# EAGLE design FLC100_remote_v1.2 (EAGLE 6.2)
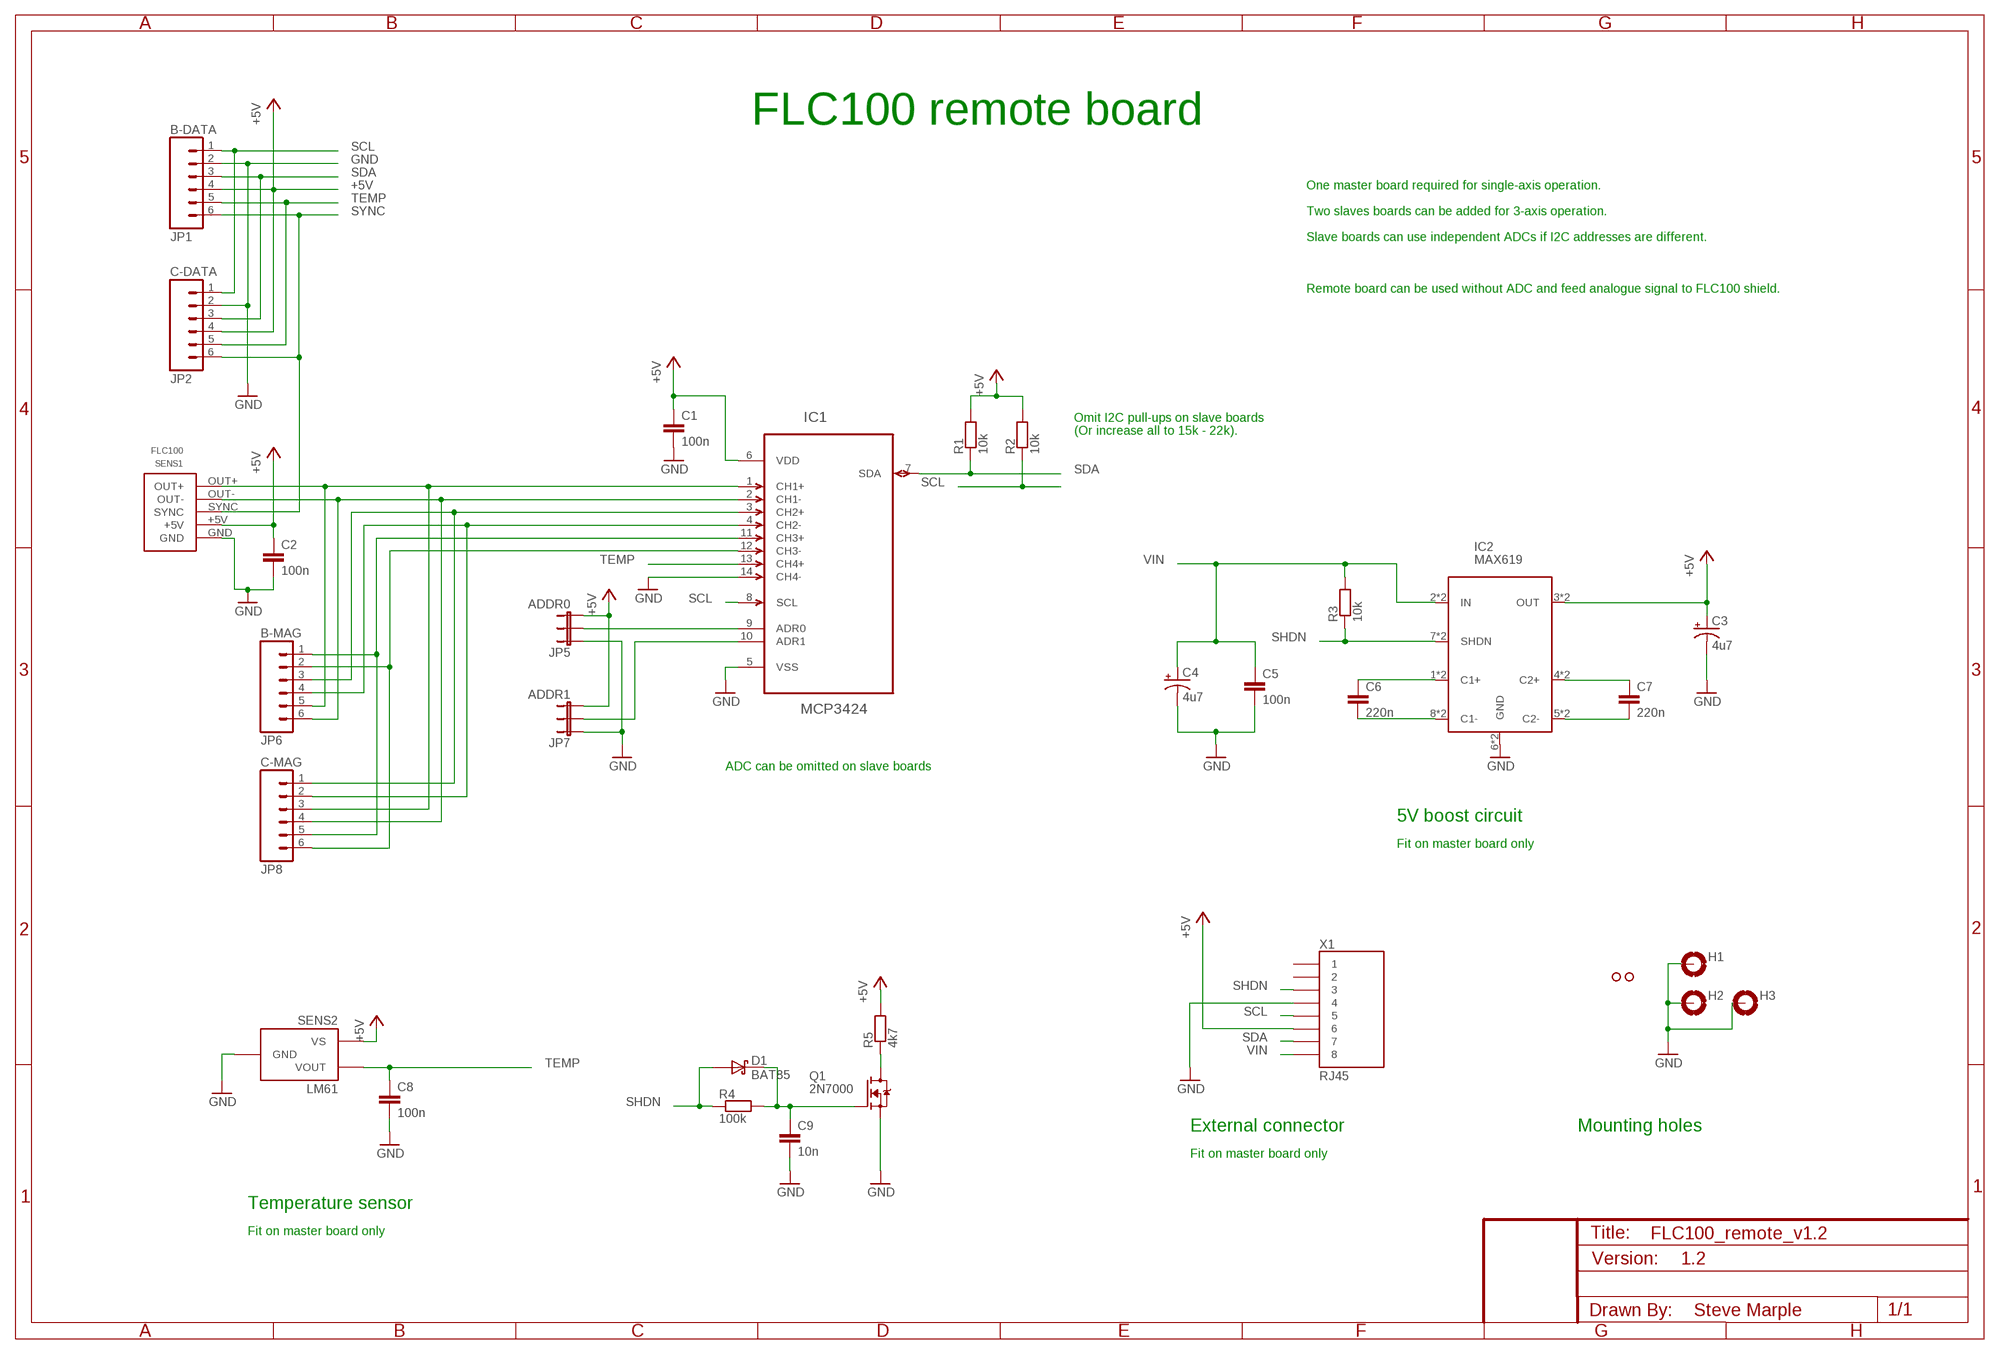
[diagram p0: schematic, sheet 1]

## Parts
C1  100n  CAPPTH  [CAP-PTH-SMALL]
C2  100n  CAPPTH  [CAP-PTH-SMALL]
C3  4u7  CAP_POLPTH2  [CPOL-RADIAL-10UF-25V]
C4  4u7  CAP_POLPTH2  [CPOL-RADIAL-10UF-25V]
C5  100n  CAPPTH  [CAP-PTH-SMALL]
C6  220n  CAPPTH1  [CAP-PTH-5MM]
C7  220n  CAPPTH1  [CAP-PTH-5MM]
C8  100n  CAPPTH  [CAP-PTH-SMALL]
C9  10n  CAPPTH  [CAP-PTH-SMALL]
D1  BAT85  DIODE-SCHOTTKY  [DIODE-TH-0.4]
H1  MOUNT-PAD-ROUND3.0  [3,0-PAD]
H2  MOUNT-PAD-ROUND3.0  [3,0-PAD]
H3  MOUNT-PAD-ROUND3.0  [3,0-PAD]
IC1  MCP3424  MCP3424-E/SLSO14  [SO14]
IC2  MAX619  MAX619DIL08/SOIC8  [DIL08-SOIC8]
JP1  B-DATA  M06FEMALE  [1X06_FEMALE]
JP2  C-DATA  M06FEMALE  [1X06_FEMALE]
JP5  ADDR0  JUMPER-3PTH  [1X03]
JP6  B-MAG  M06FEMALE  [1X06_FEMALE]
JP7  ADDR1  JUMPER-3PTH  [1X03]
JP8  C-MAG  M06FEMALE  [1X06_FEMALE]
Q1  2N7000  [TO-92]
R1  10k  RESISTOR  [RES-AXIAL-0.4]
R2  10k  RESISTOR  [RES-AXIAL-0.4]
R3  10k  RESISTOR  [RES-AXIAL-0.4]
R4  100k  RESISTOR  [RES-AXIAL-0.4]
R5  4k7  RESISTOR  [RES-AXIAL-0.4]
SENS1  FLC100  [FLC100]
SENS2  LM61  [TO-92]
U$1  PAD  [PAD]
U$2  PAD  [PAD]
X1  RJ45  RJ45-8PTH  [RJ45-8]

## Nets
+5V [power]: C1.1 C2.1 C3.1(+) IC1.6(VDD) IC2.3(OUT) IC2.3@1(OUT) JP1.4 JP2.4 JP5.3 JP7.3 R1.P$2 R2.P$2 R5.P$2 SENS1.+5V SENS2.1(VS) X1.6
CH1+: IC1.1(CH1+) JP6.5 JP8.3 SENS1.OUT+
CH1-: IC1.2(CH1-) JP6.6 JP8.4 SENS1.OUT-
CH2+: IC1.3(CH2+) JP6.3 JP8.1
CH2-: IC1.4(CH2-) JP6.4 JP8.2
CH3+: IC1.11(CH3+) JP6.1 JP8.5
CH3-: IC1.12(CH3-) JP6.2 JP8.6
GND [power]: C1.2 C2.2 C3.2(-) C4.2(-) C5.2 C8.2 C9.2 H1.B3,0(MOUNT) H2.B3,0(MOUNT) H3.B3,0(MOUNT) IC1.5(VSS) IC1.14(CH4-) IC2.6(GND) IC2.6@1(GND) JP1.2 JP2.2 JP5.1 JP7.1 Q1.1(S) SENS1.GND SENS2.3(GND) X1.4
N$2: C9.1 D1.C Q1.2(G) R4.P$2
N$3: Q1.3(D) R5.P$1
N$6: C6.2 IC2.8(C1-) IC2.8@1(C1-)
N$7: C6.1 IC2.1(C1+) IC2.1@1(C1+)
N$11: IC1.9(ADR0) JP5.2
N$12: IC1.10(ADR1) JP7.2
N$14: C7.1 IC2.4(C2+) IC2.4@1(C2+)
N$15: C7.2 IC2.5(C2-) IC2.5@1(C2-)
SCL: IC1.8(SCL) JP1.1 JP2.1 R2.P$1 X1.5
SDA: IC1.7(SDA) JP1.3 JP2.3 R1.P$1 X1.7
SHDN: D1.A IC2.7(SHDN) IC2.7@1(SHDN) R3.P$1 R4.P$1 X1.3
SYNC: JP1.6 JP2.6 SENS1.SYNC
TEMP: C8.1 IC1.13(CH4+) JP1.5 JP2.5 SENS2.2(VOUT)
VIN [power]: C4.1(+) C5.1 IC2.2(IN) IC2.2@1(IN) R3.P$2 X1.8
Unconnected: U$1.1 U$2.1 X1.1 X1.2

## Notes on the sheet
- FLC100 remote board
- One master board required for single-axis operation.
- Two slaves boards can be added for 3-axis operation.
- Slave boards can use independent ADCs if I2C addresses are different.
- Remote board can be used without ADC and feed analogue signal to FLC100 shield.
- Omit I2C pull-ups on slave boards
- (Or increase all to 15k - 22k).
- ADC can be omitted on slave boards
- 5V boost circuit
- Fit on master board only
- External connector | Mounting holes
- Fit on master board only
- Temperature sensor
- Fit on master board only
- 1.2
- Steve Marple

## Library data of the parts
C1 C2 C5-C9 = SparkFun:CAP: Capacitor Standard 0603 ceramic capacitor, and 0.1" leaded capacitor.
C3 C4 = SparkFun:CAP_POL: Capacitor Polarized These are standard SMD and PTH capacitors. Normally 10uF, 47uF, and 100uF in electrolytic and tantalum varieties. Always verify the external diameter of the through hole cap, it varies with capacity, voltage, and manufacturer. The EIA devices should be standard.
D1 = SteveMarple:DIODE-SCHOTTKY
H1-H3 = holes:MOUNT-PAD-ROUND: MOUNTING PAD, round
IC1 = SteveMarple:MCP3424-E/SL: Analog-to-Digital Converter Footprint adapted from Eagle file from Onecall web site
IC2 = SteveMarple:MAX619: Regulated 5V charge pump DC-DC converter
JP1 JP2 JP6 JP8 = SteveMarple:M06: Header 6 Standard 6-pin 0.1" header. Use with straight break away headers (SKU : PRT-00116), right angle break away headers (PRT-00553), swiss pins (PRT-00743), machine pins (PRT-00117), and female headers (PRT-00115). Molex polarized connector foot print use with SKU : PRT-08094 with associated crimp pins and housings. NOTES ON THE VARIANTS LOCK and LOCK_LONGPADS... This footprint was designed to help hold the alignment of a through-hole component (i.e. 6-pin header) while soldering it into place. You may notice that each hole has been shifted either up or down by 0.005 of an inch from it's more standard position (which is a perfectly straight line). This slight alteration caused the pins (the squares in the middle) to touch the edges of the holes. Because they are alternating, it causes a "brace" to hold the component in place. 0.005 has proven to be the perfect amount of "off-center" position when using our standard breakaway headers. Although looks a little odd when you look at the bare footprint, once you have a header in there, the alteration is very hard to notice. Also, if you push a header all the way into place, it is covered up entirely on the bottom side. This idea of altering the position of holes to aid alignment will be further integrated into the Sparkfun Library for other footprints. It can help hold any component with 3 or more connection pins.
JP5 JP7 = SparkFun:JUMPER-3
Q1 = SteveMarple:2N7000: 2N7000 FET
R1-R5 = SteveMarple:RESISTOR: 1/4W PTH resistor
SENS1 = SteveMarple:FLC100: Stefan Mayer Instruments FLC100 fluxgate magnetometer sensor
SENS2 = SteveMarple:LM61
U$1 U$2 = SteveMarple:PAD
X1 = SteveMarple:RJ45-8: RJ45 Jack Simple RJ45, 8-pin connection - connector for common Cat5, Cat5e, and Cat6 Ethernet cables. Footprint not yet proven in production. Connector sku is PRT-00643; Breakout PCB sku is BOB-00716.

## Net classes
1 power: width 0.381 mm

## Board
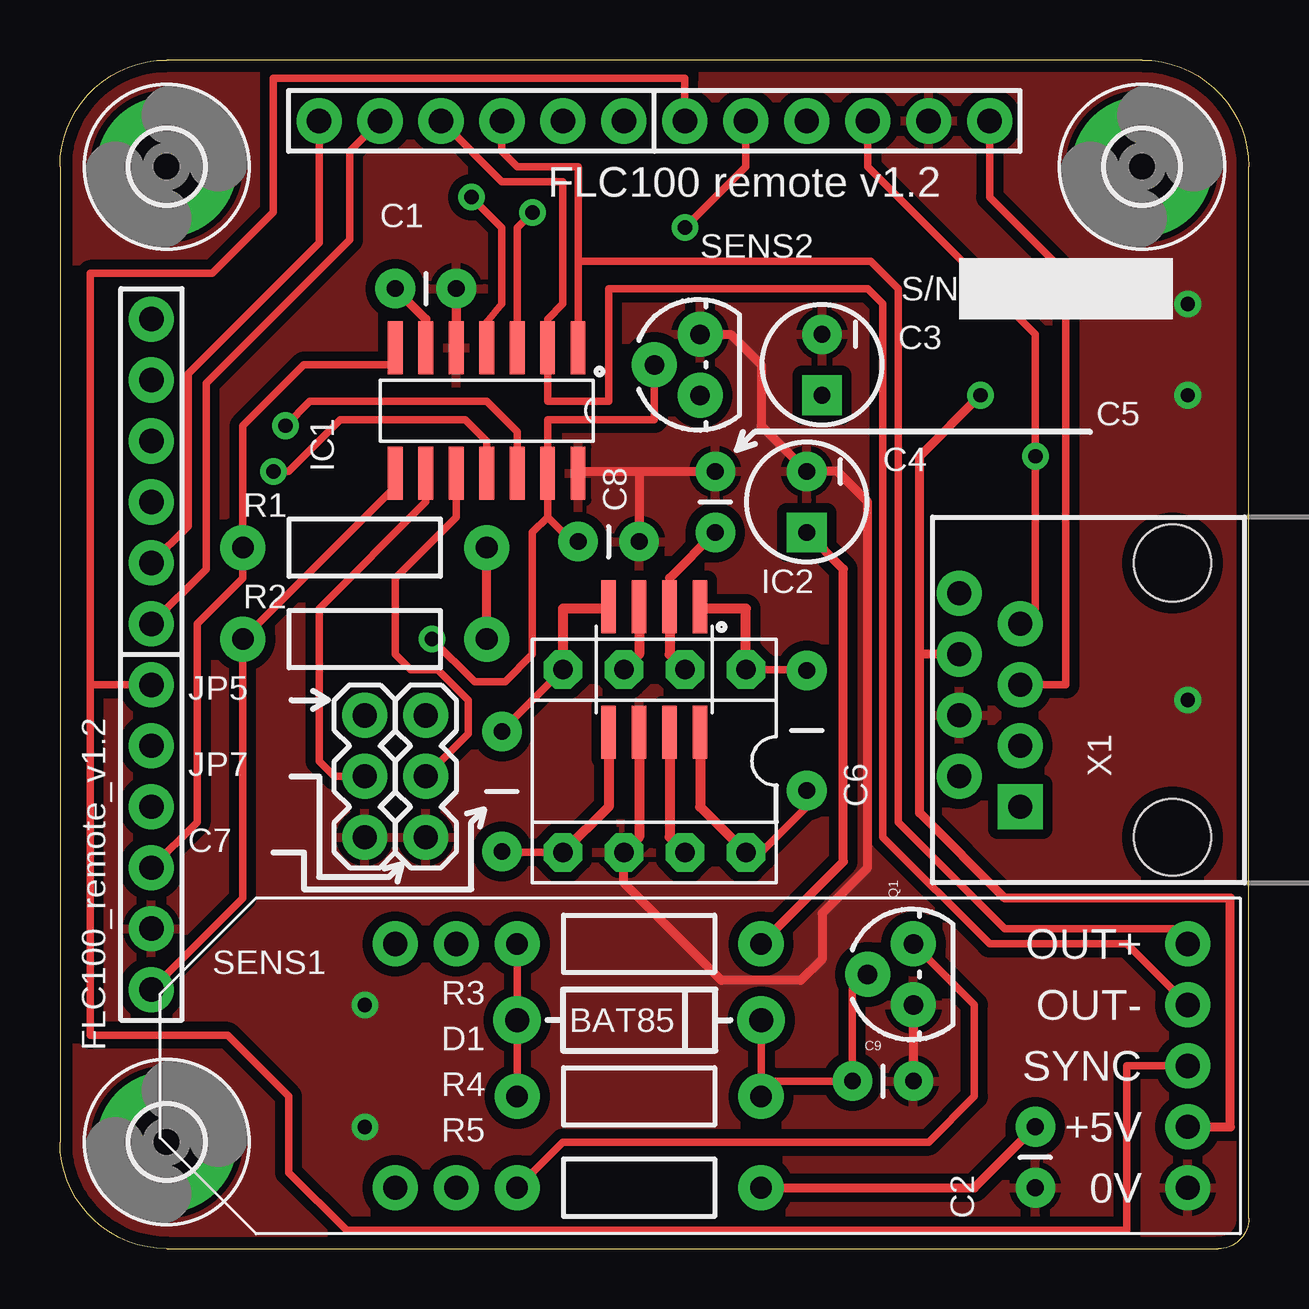
[diagram p1: board, top side]
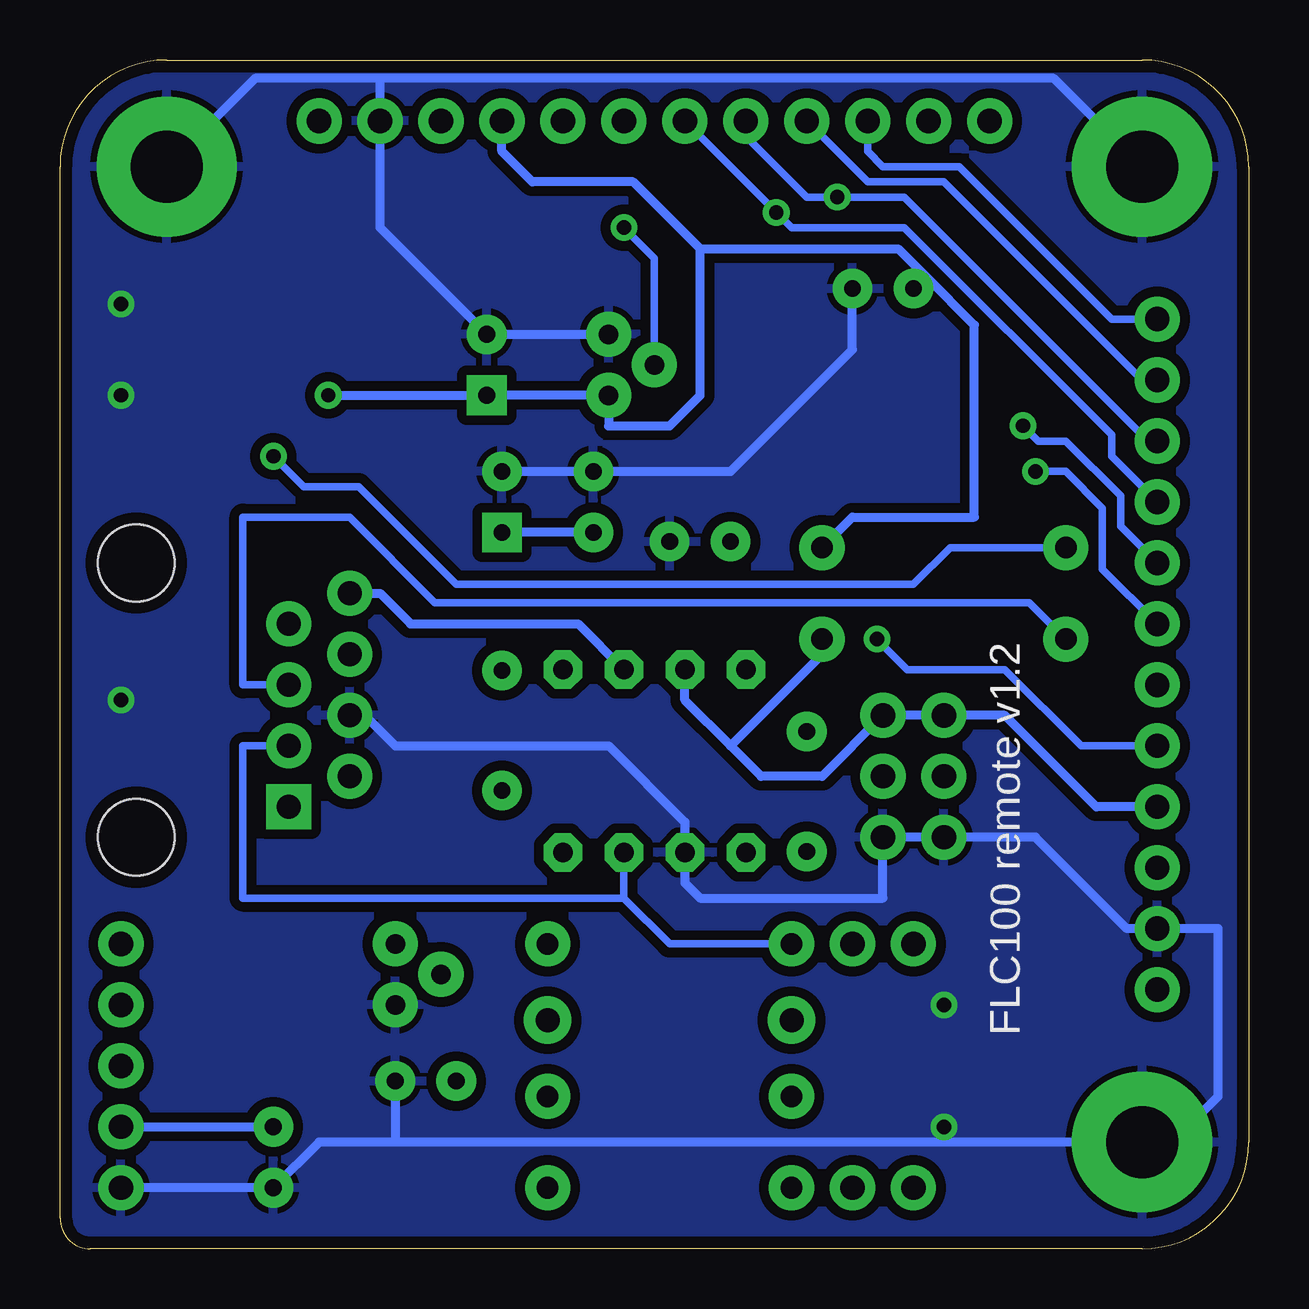
[diagram p2: board, bottom side, seen from below]

Size 49.53 x 49.53 mm. Coordinates in mm from the lower left corner, seen from the top.
Outline: 4.45,0 48.26,0 arc90 49.53,1.27 49.53,45.09 arc90 45.09,49.53 4.45,49.53 arc90 0,45.09 0,4.45 arc90 4.45,0
Copper layers (1*16): Top 0.035mm / dielectric 1.5mm / Bottom 0.035mm
Design rules: minimum track width 10mil, minimum drill 20mil, track to track 10mil, track to pad 10mil, pad to pad 10mil, via to via 10mil, smd to smd 10mil, copper to edge 0.5mm, drill to drill 8mil, minimum pad ring 12mil, minimum via ring 10mil, stop-mask expansion 4mil, vias tented up to drill 25mil, thermal gap 10mil

### Footprints (pad centres in the part's own frame; a part is rotated, then mirrored left to right if it is on the bottom)
CAP-PTH-SMALL = drill 0.7 pad 1.651: 1 0,0; 2 2.54,0
CPOL-RADIAL-10UF-25V = drill 0.7 pad 1.651 square: 1 1.27,0 | drill 0.7 pad 1.651: 2 -1.27,0
CAP-PTH-5MM = drill 0.7 pad 1.651: 1 -2.5,0; 2 2.5,0
DIODE-TH-0.4 = drill 1 pad 1.981: A -5.08,0; C 5.08,0
3,0-PAD = drill 3 pad 5.842: B3,0 0,0
SO14 = smd 0.61 x 2.21: 1 -3.81,-2.616; 2 -2.54,-2.616; 3 -1.27,-2.616; 4 0,-2.616; 5 1.27,-2.616; 6 2.54,-2.616; 7 3.81,-2.616; 8 3.81,2.616; 9 2.54,2.616; 10 1.27,2.616; 11 0,2.616; 12 -1.27,2.616; 13 -2.54,2.616; 14 -3.81,2.616
DIL08-SOIC8 = drill 0.813 pad 1.6 octagon: 1 -3.81,-3.81; 2 -1.27,-3.81; 3 1.27,-3.81; 4 3.81,-3.81; 5 3.81,3.81; 6 1.27,3.81; 7 -1.27,3.81; 8 -3.81,3.81 | smd 0.61 x 2.21: 1@1 -1.905,-6.426; 2@1 -0.635,-6.426; 3@1 0.635,-6.426; 4@1 1.905,-6.426; 5@1 1.905,-1.194; 6@1 0.635,-1.194; 7@1 -0.635,-1.194; 8@1 -1.905,-1.194
1X06_FEMALE = drill 1.016 pad 1.88: 1 0,0; 2 2.54,0; 3 5.08,0; 4 7.62,0; 5 10.16,0; 6 12.7,0
1X03 = drill 1.016 pad 1.88: 1 0,0; 2 2.54,0; 3 5.08,0
TO-92 = drill 0.813 pad 1.88: 1 -1.27,0; 2 0,1.905; 3 1.27,0
RES-AXIAL-0.4 = drill 0.9 pad 1.88: P$1 -5.08,0; P$2 5.08,0
FLC100 = drill 1.016 pad 1.88: +5V -20.32,2.54; GND -20.32,5.08; NC@0 12.7,5.08; NC@1 12.7,-5.08; OUT+ -20.32,-5.08; OUT- -20.32,-2.54; SYNC -20.32,0
PAD = drill 1.016 pad 1.88: 1 0,0
RJ45-8 = drill 1 pad 1.88 square: 1 -4.445,6.35 | drill 1 pad 1.88: 2 -3.175,8.89; 3 -1.905,6.35; 4 -0.635,8.89; 5 0.635,6.35; 6 1.905,8.89; 7 3.175,6.35; 8 4.445,8.89 | hole 3.2: -5.715,0; 5.715,0

### Placement (x,y rotation side)
C1  13.97,40.01 0 top
C2  40.64,5.08 270 top
C3  31.75,36.83 270 top
C4  31.11,31.11 270 top
C5  27.3,29.84 90 top
C6  31.11,21.59 270 top
C7  18.41,19.05 270 top
C8  21.59,29.46 0 top
C9  33.02,6.99 0 top
D1  24.13,9.53 0 top
H1  4.45,4.45 0 top
H2  45.09,45.09 0 top
H3  4.45,45.09 0 top
IC1  17.78,34.92 180 top
IC2  24.77,20.32 180 top
JP1  3.81,10.79 90 top
JP2  38.73,46.99 180 top
JP5  12.7,17.14 90 top
JP6  3.81,26.04 90 top
JP7  15.24,17.14 90 top
JP8  23.5,46.99 180 top
Q1  35.56,11.43 90 top
R1  12.7,29.21 0 top
R2  12.7,25.4 0 top
R3  24.13,12.7 0 top
R4  24.13,6.35 0 top
R5  24.13,2.54 0 top
SENS1  26.67,7.62 180 top
SENS2  26.67,36.83 90 top
U$1  16.51,12.7 0 top
U$2  16.51,2.54 0 top
X1  46.35,22.86 90 top

### Tracks (layer width: path | path; a pad name or v marks a point on that pad's centre or on a via)
+5V  (via drill 0.6)
  Top 0.381: IC1.6 15.24,38.73 C1.1 | 35.81,24.77 35.81,18.16 39.37,14.61 48.77,14.61 48.77,5.08 SENS1.+5V | X1.6 35.81,24.77 | 35.81,24.77 35.81,33.02 v38.35,35.56 | R2.P$2 R1.P$2 | IC2.3@1 24.13,26.67 24.13,24.77 | R5.P$2 38.1,2.54 C2.1
  Bottom 0.381: JP1.4 6.35,18.41 10.16,22.23 JP5.3 JP7.3 17.78,19.68 20.32,19.68 21.59,20.95 | 22.86,41.66 25.65,44.45 29.84,44.45 31.11,45.72 JP2.4 | 22.86,41.66 14.61,41.66 13.46,40.51 | v38.35,35.56 C3.1 SENS2.1 26.67,34.29 24.13,34.29 22.86,35.56 22.86,41.66 | R2.P$2 17.78,24.77 21.59,20.95 | 21.59,20.95 23.5,22.86 IC2.3 | R1.P$2 16.51,30.48 11.43,30.48 11.43,38.48 13.46,40.51 | SENS1.+5V C2.1 | C1.1 13.46,40.51
CH1+
  Top 0.305: 21.59,41.15 21.59,45.09 19.05,45.09 18.41,45.72 JP8.3 | SENS1.OUT+ 46.35,13.34 39.37,13.34 34.92,17.78 34.92,40.01 33.78,41.15 21.59,41.15 | 21.59,41.15 IC1.1
  Bottom 0.305: JP6.5 4.45,36.2 12.7,44.45 15.88,44.45 JP8.3
CH1-
  Top 0.305: JP8.4 18.41,44.45 20.95,44.45 20.95,39.37 20.32,38.73 IC1.2 20.32,35.31 22.86,35.31 22.86,40.01 33.66,40.01 34.29,39.37 34.29,17.14 38.73,12.7 44.45,12.7 SENS1.OUT-
  Bottom 0.305: JP6.6 5.71,38.73 12.06,45.09 15.24,45.09 15.88,45.72 JP8.4
CH2+  (via drill 0.6)
  Top 0.305: v19.68,43.18 19.05,42.55 IC1.3
  Bottom 0.305: JP6.3 5.71,33.02 5.71,33.91 14.35,42.55 19.05,42.55 v19.68,43.18 JP8.1
CH2-  (via drill 0.6)
  Top 0.305: IC1.4 17.78,38.61 18.41,39.37 18.41,42.55 v17.14,43.81
  Bottom 0.305: JP6.4 4.19,33.66 14.35,43.81 v17.14,43.81 18.41,43.81 20.95,46.35 JP8.2
CH3+  (via drill 0.6)
  Top 0.305: JP6.1 6.1,28.32 6.1,36.07 12.06,42.04 12.06,45.72 JP8.5 | IC1.11 17.78,33.66 16.89,34.54 11.68,34.54 9.53,32.38 v8.89,32.38
  Bottom 0.305: v8.89,32.38 7.62,32.38 6.1,30.86 6.1,28.32 JP6.1
CH3-  (via drill 0.6)
  Top 0.305: JP8.6 10.79,41.91 5.33,36.45 5.33,30.1 JP6.2 | IC1.12 19.05,34.04 17.78,35.31 10.41,35.31 v9.4,34.29
  Bottom 0.305: v9.4,34.29 8.76,33.66 7.62,33.66 5.33,31.37 5.33,30.1 JP6.2
GND  (via drill 0.6)
  Top 0.381: C1.2 IC1.5 | SENS2.3 27.94,38.1 29.21,36.83 29.21,34.29 C4.2 32.38,32.38 33.66,31.11 33.66,15.88 31.75,13.97 31.75,12.06 30.86,11.18 27.56,11.18 23.5,15.24 IC2.6 | IC1.14 21.59,32.38 24.13,32.38 | 24.13,32.38 C8.2 | IC2.6@1 24.13,21.59 24.13,17.14 | 24.13,32.38 C5.2 | Q1.1 C9.2
  Bottom 0.381: H3.B3,0 8.13,48.77 36.2,48.77 | 36.2,48.77 41.4,48.77 H2.B3,0 | 23.5,15.88 IC2.6 | SENS2.3 C3.2 36.2,42.55 JP2.2 36.2,48.77 | C4.2 C5.2 21.59,32.38 16.51,37.47 C1.2 | X1.4 36.83,22.23 35.56,20.95 26.67,20.95 23.5,17.78 IC2.6 | IC2.6 23.5,15.24 22.86,14.61 15.24,14.61 JP7.1 JP5.1 8.89,17.14 5.08,13.34 JP1.2 1.27,13.34 1.27,6.35 3.17,4.45 H1.B3,0 35.56,4.45 | 35.56,4.45 38.73,4.45 C2.2 SENS1.GND | C9.2 35.56,4.45
  other vias: 46.99,22.86 46.99,39.37 46.99,35.56 12.7,5.08 12.7,10.16
  pour Bottom (isolate 0.406): -1.27,-1.27 -1.27,50.8 50.8,50.8 50.8,-1.27
  pour Top (isolate 0.406): -2.54,52.07 52.07,52.07 52.07,-2.54 -2.54,-2.54
N$2
  Top 0.305: D1.C R4.P$2 29.21,6.99 C9.1 33.02,10.79 Q1.2
N$3
  Top 0.305: R5.P$1 20.95,4.45 36.2,4.45 38.1,6.35 38.1,10.16 Q1.3
N$6
  Top 0.254: IC2.8@1 26.67,21.59 26.67,18.41
  Top 0.305: IC2.8 29.21,16.51 31.11,18.41 C6.2
N$7
  Top 0.254: 26.67,26.67 IC2.1@1
  Top 0.305: C6.1 31.11,24.13 IC2.1
N$11
  Top 0.305: JP5.2 11.43,19.68 10.79,20.32 10.79,26.67 15.24,31.11 IC1.9
N$12
  Top 0.305: JP7.2 17.02,21.46 17.02,22.86 15.75,24.13 14.61,24.13 13.97,24.77 13.97,27.94 16.51,30.48 IC1.10
N$14
  Top 0.254: IC2.4@1 22.86,26.67 20.95,26.67
  Top 0.305: IC2.4 18.41,21.59 C7.1
N$15
  Top 0.254: IC2.5@1 22.86,21.59 22.86,18.41
  Top 0.305: C7.2 18.41,16.51 IC2.5
SCL
  Top 0.305: JP1.1 7.62,14.61 R2.P$1 13.97,31.75 IC1.8 | JP2.1 38.73,43.81 41.91,40.64 41.91,23.5 X1.5
  Bottom 0.305: X1.5 41.91,23.5 41.91,30.48 37.47,30.48 33.91,26.92 9.14,26.92 R2.P$1
SDA  (via drill 0.6)
  Top 0.305: IC1.7 13.97,36.83 10.16,36.83 7.62,34.29 R1.P$1 7.62,27.94 5.71,26.04 5.71,17.78 JP1.3 | JP2.3 33.66,45.09 40.64,38.1 v40.64,33.02 40.64,26.67 X1.7
  Bottom 0.305: R1.P$1 12.45,29.21 13.97,27.69 33.02,27.69 37.08,31.75 39.37,31.75 v40.64,33.02
SHDN
  Top 0.254: IC2.7@1 25.4,21.59 25.4,17.14
  Top 0.305: R3.P$1 D1.A R4.P$1
  Bottom 0.305: IC2.7 26.04,14.61 | R3.P$1 24.13,12.7 26.04,14.61 | X1.3 41.91,20.95 41.91,14.61 26.04,14.61
SYNC
  Top 0.305: 1.27,23.5 1.27,40.64 6.35,40.64 8.89,43.18 8.89,48.77 26.04,48.77 JP2.6 | 1.27,23.5 JP1.6 | SENS1.SYNC 44.45,7.62 44.45,0.76 11.94,0.76 9.53,3.17 9.53,6.35 6.99,8.89 1.27,8.89 1.27,23.5
TEMP  (via drill 0.6)
  Top 0.305: v15.49,25.4 17.27,23.62 18.54,23.62 19.68,24.77 19.68,29.84 20.32,30.48 | JP2.5 28.57,45.09 v26.04,42.55 | 20.32,30.48 21.34,29.46 C8.1 | 20.32,30.48 IC1.13 20.32,34.54 24.77,34.54 SENS2.2
  Bottom 0.305: JP1.5 6.99,20.95 10.16,24.13 14.22,24.13 v15.49,25.4 | SENS2.2 24.77,41.27 v26.04,42.55
VIN
  Top 0.381: C5.1 25.4,27.94 IC2.2@1 25.4,26.67 25.4,24.77 | R3.P$2 32.64,16.13 32.64,28.32 C4.1
  Bottom 0.381: C5.1 C4.1 | X1.8 36.2,27.3 34.92,26.04 27.94,26.04 IC2.2

### Text on the board
_tsilk: FLC100 remote v1.2 | S/N
_bsilk: FLC100 remote v1.2